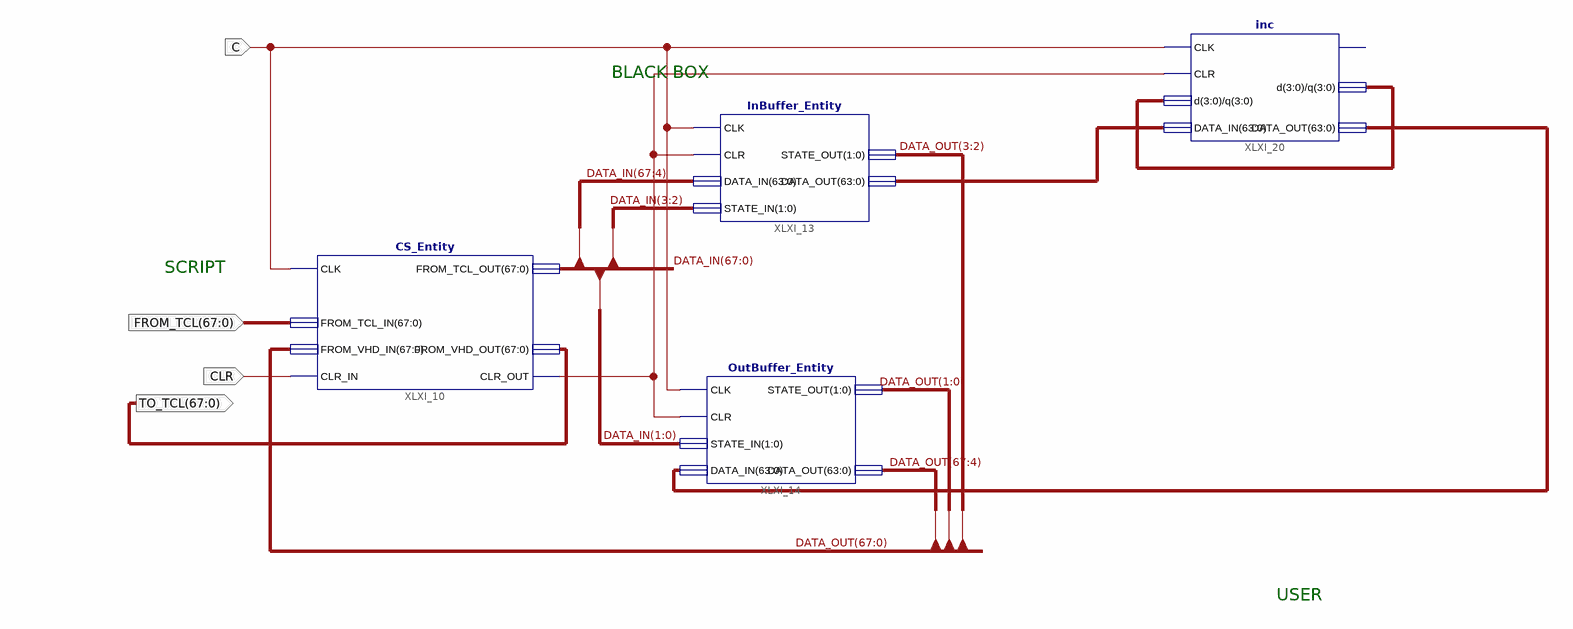
[diagram p0: schematic sheet 1]
// Xilinx ISE schematic top4.sch (spartan6) as structural Verilog: 4 symbols, 4 ports
module top4 (
  input  [67:0] FROM_TCL,
  input  C,
  input  CLR,
  output [67:0] TO_TCL
);

  wire XLXN_38;
  wire [3:0] XLXN_49;
  wire [63:0] XLXN_26, XLXN_28;
  wire [67:0] DATA_IN, DATA_OUT;

  CS_Entity XLXI_10 (
    .CLK(C), .CLR_IN(CLR), .FROM_TCL_IN(FROM_TCL), .FROM_VHD_IN(DATA_OUT), .CLR_OUT(XLXN_38),
    .FROM_TCL_OUT(DATA_IN), .FROM_VHD_OUT(TO_TCL));
  InBuffer_Entity XLXI_13 (
    .CLK(C), .CLR(XLXN_38), .STATE_IN(DATA_IN[3:2]), .DATA_IN(DATA_IN[67:4]), .STATE_OUT(DATA_OUT[3:2]),
    .DATA_OUT(XLXN_26));
  OutBuffer_Entity XLXI_14 (
    .CLK(C), .CLR(XLXN_38), .STATE_IN(DATA_IN[1:0]), .DATA_IN(XLXN_28), .STATE_OUT(DATA_OUT[1:0]),
    .DATA_OUT(DATA_OUT[67:4]));
  inc XLXI_20 (.CLK(C), .CLR(XLXN_38), .d(XLXN_49), .DATA_IN(XLXN_26), .q(XLXN_49), .DATA_OUT(XLXN_28));  // open: CLR_O

  // Notes on the sheet:
  //   BLACK BOX
  //   SCRIPT
  //   USER
endmodule
